# Altium schematic sheet PART10_Ast_Multivib_w_DC_DC_COnv.SchDoc
size A4
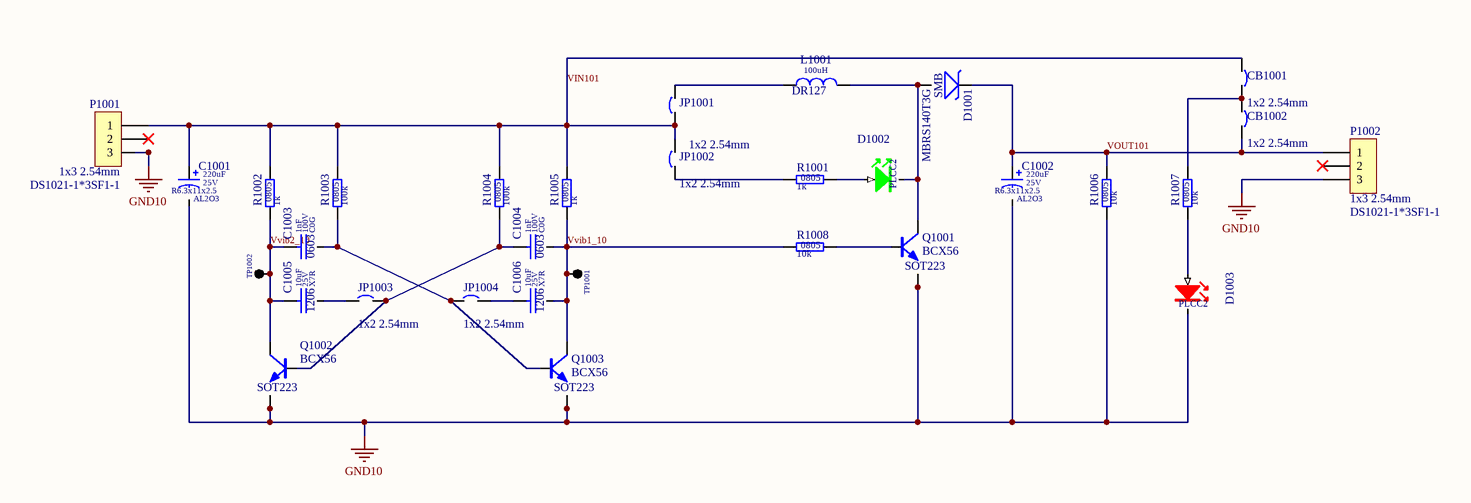
[diagram p0: PART10_Ast_Multivib_w_DC_DC_COnv.SchDoc]

## Parts
C1001  value 220uF  Dielectric: AL2O3  SCH_Footprint: R6.3x11x2.5  Voltage: 25V  [C_R6.3x11x2.5]  (hidden comment: Electrolytic Capacitor)
C1002  value 220uF  Dielectric: AL2O3  SCH_Footprint: R6.3x11x2.5  Voltage: 25V  [C_R6.3x11x2.5]  (hidden comment: Electrolytic Capacitor)
C1003  value 1nF  Dielectric: C0G  Voltage: 100V  SCH_Footprint: 0603  [C_0603_1608]  (hidden comment: Ceramic C0G)
C1004  value 1nF  Dielectric: C0G  Voltage: 100V  SCH_Footprint: 0603  [C_0603_1608]  (hidden comment: Ceramic C0G)
C1005  value 10uF  Dielectric: X7R  Voltage: 25V  SCH_Footprint: 1206  [C_1206_3216]  (hidden comment: Ceramic X7R)
C1006  value 10uF  Dielectric: X7R  Voltage: 25V  SCH_Footprint: 1206  [C_1206_3216]  (hidden comment: Ceramic X7R)
CB1001  SCH_Footprint: 1x2 2.54mm  [P_HEADER_1x2_2.54]  (hidden comment: Goldpin)
CB1002  SCH_Footprint: 1x2 2.54mm  [P_HEADER_1x2_2.54]  (hidden comment: Goldpin)
D1001  SCH_Footprint: SMB  [SMB_DO-214AA]  (hidden comment: MBRS140T3G)
D1002  SCH_Footprint: PLCC2  [OL_PLCC2_3X2X13]
D1003  SCH_Footprint: PLCC2  [OL_PLCC2_3X2X13]
JP1001  SCH_Footprint: 1x2 2.54mm  [P_HEADER_1x2_2.54]  (hidden comment: Goldpin)
JP1002  SCH_Footprint: 1x2 2.54mm  [P_HEADER_1x2_2.54]  (hidden comment: Goldpin)
JP1003  SCH_Footprint: 1x2 2.54mm  [P_HEADER_1x2_2.54]  (hidden comment: Goldpin)
JP1004  SCH_Footprint: 1x2 2.54mm  [P_HEADER_1x2_2.54]  (hidden comment: Goldpin)
L1001  value 100uH  SCH_Footprint: DR127  [L_DR127]  (hidden comment: Inductor)
P1001  value DS1021-1*3SF1-1  SCH_Footprint: 1x3 2.54mm  [P_HEADER_1x3_2.54]  (hidden comment: Goldpin)
P1002  value DS1021-1*3SF1-1  SCH_Footprint: 1x3 2.54mm  [P_HEADER_1x3_2.54]  (hidden comment: Goldpin)
Q1001  SCH_Footprint: SOT223  [SOT-223_M]  (hidden comment: BCX56)
Q1002  SCH_Footprint: SOT223  [SOT-223_M]  (hidden comment: BCX56)
Q1003  SCH_Footprint: SOT223  [SOT-223_M]  (hidden comment: BCX56)
R1001  value 1k  SCH_Footprint: 0805  [R_0805_2012]  (hidden comment: Resistor)
R1002  value 1k  SCH_Footprint: 0805  [R_0805_2012]  (hidden comment: Resistor)
R1003  value 100k  SCH_Footprint: 0805  [R_0805_2012]  (hidden comment: Resistor)
R1004  value 100k  SCH_Footprint: 0805  [R_0805_2012]  (hidden comment: Resistor)
R1005  value 1k  SCH_Footprint: 0805  [R_0805_2012]  (hidden comment: Resistor)
R1006  value 10k  SCH_Footprint: 0805  [R_0805_2012]  (hidden comment: Resistor)
R1007  value 10k  SCH_Footprint: 0805  [R_0805_2012]  (hidden comment: Resistor)
R1008  value 10k  SCH_Footprint: 0805  [R_0805_2012]  (hidden comment: Resistor)
TP1001  Single pin  [TP_1PIN]  (value not drawn)
TP1002  Single pin  [TP_1PIN]  (value not drawn)

## Nets
GND10: C1001.2 C1002.2 D1003.1(K) P1001.3 P1002.3 Q1001.1(C) Q1001.3(E) Q1002.1(C) Q1002.3(E) Q1003.1(C) Q1003.3(E) R1006.1
VIN101: C1001.1 CB1001.1 JP1001.1 JP1002.2 P1001.1 R1002.2 R1003.2 R1004.2 R1005.2
VOUT101: C1002.1 CB1002.2 D1001.1 P1002.1 R1006.2
Vvib1_10: C1004.2 C1006.2 Q1003.2(C) R1005.1 R1008.1 TP1001.1(TP)
Vvib2_10: C1003.1 C1005.1 Q1002.2(C) R1002.1 TP1002.1(TP)
NetC1003_2: C1003.2 JP1004.1 Q1003.4(B) R1003.1
NetC1004_1: C1004.1 JP1003.2 Q1002.4(B) R1004.1
NetC1005_2: C1005.2 JP1003.1
NetC1006_1: C1006.1 JP1004.2
NetCB1001_2: CB1001.2 CB1002.1 R1007.2
NetD1001_2: D1001.2 D1002.1(K) L1001.2 Q1001.2(C)
NetD1002_2: D1002.2(A) R1001.2
NetD1003_2: D1003.2(A) R1007.1
NetJP1001_2: JP1001.2 L1001.1
NetJP1002_1: JP1002.1 R1001.1
NetQ1001_4: Q1001.4(B) R1008.2

Not connected (* = marked no-connect by the designer): P1001 2*; P1002 2*

## Library data of the parts
C1001 C1002 = CE_220uF_25V_6.3x11x2.5_LESR_20: Polarized Capacitor; Manufacturer: Samxon; Manufacturer Part Number: GF 220U/25V; Tolerance (%): 20; Part Number: CE_220uF_25V_6.3x11x2.5_LESR_20; HelpURL: http://www.tme.eu/pl/Document/9fe41abe6e7b7973ea4089f212d099cc/E-GF_series.pdf; Supplier 1: TME; Supplier Part Number 1: GF220/25; Supplier 2: RS Components; Supplier 3: Farnell; Supplier 4: Mouser; Supplier 5: Digi-Key
C1003 C1004 = C_1nF_100V_C0G_0603_5: Capacitor; Manufacturer: Murata; Manufacturer Part Number: GRM1885C2A102JA01D; Tolerance (%): 5; Part Number: C_1nF_100V_C0G_0603_5; HelpURL: https://www.murata.com/~/media/webrenewal/support/library/catalog/products/capacitor/mlcc/c02e.ashx; Supplier 1: TME; Supplier Part Number 1: GRM1885C2A102JA01D; Supplier 2: RS Components; Supplier Part Number 2: 7235972; Supplier 3: Farnell; Supplier Part Number 3: 2494226; Supplier 4: Mouser; Supplier Part Number 4: 81-GRM1885C2A102JA01; Supplier 5: Digi-Key; Supplier Part Number 5: 490-3281-1-ND
C1005 C1006 = C_10uF_25V_X7R_1206_10: Capacitor; Manufacturer: Samsung Electro-Mechanics; Manufacturer Part Number: CL31B106KAHNNNE; Tolerance (%): 10; Part Number: C_10uF_25V_X7R_1206_10; HelpURL: http://www.tme.eu/pl/Document/4a42202b32dab16128fe107dd69598cc/samsung-chip-cap.pdf; Supplier 1: TME; Supplier Part Number 1: CL31B106KAHNNNE; Supplier 2: RS Components; Supplier 3: Farnell; Supplier 4: Mouser; Supplier 5: Digi-Key
CB1001 CB1002 JP1001-JP1004 = CB_GOLDPIN: Circuit Breaker; Part Number: CB_GOLDPIN; Component Type: Standard; Supplier 1: TME; Supplier 2: RS Components; Supplier 3: Farnell; Supplier 4: Mouser; Supplier 5: Digi-Key
D1001 = DS_MBRS140T3G_1A_40V_SMB: Manufacturer: ON Semiconductor; Voltage: 40V; Current: 1A; Value: MBRS140T3G; Part Number: DS_MBRS140T3G_1A_40V_SMB; Manufacturer Part Number: MBRS140T3G; Supplier 1: TME; Supplier 2: RS Components; Supplier 3: Farnell; Supplier 4: Mouser; Supplier 5: Digi-Key; Supplier Part Number 5: MBRS140T3GOSCT-ND
D1002 = OL_G_PLCC2: LED GREEN; Part Number: OL_G_PLCC2; Supplier 1: TME; Supplier 2: RS Components; Supplier 3: Farnell; Supplier 4: Mouser; Supplier Part Number 4: 720-LGT676P1Q224Z; Supplier 5: Digi-Key; Supplier Part Number 5: 475-1403-1-ND
D1003 = OL_R_PLCC2: LED_RED; Part Number: OL_R_PLCC2; Supplier 1: TME; Supplier 2: RS Components; Supplier 3: Farnell; Supplier 4: Mouser; Supplier Part Number 4: 720-LST676-R1S1-1-Z; Supplier 5: Digi-Key; Supplier Part Number 5: 475-2683-1-ND
L1001 = L_100uH_1.96A_DR127: Induction; Manufacturer: Eaton; Manufacturer Part Number: DR127-101-R; Current: 1.96A; Resistance: 163mR; Part Number: L_100uH_1.96A_DR127; HelpURL: https://datasheet.octopart.com/DR127-101-R-Eaton-datasheet-552538.pdf; Supplier 1: TME; Supplier 2: RS Components; Supplier Part Number 2: 7701003; Supplier 3: Farnell; Supplier Part Number 3: 1463472; Supplier 4: Mouser; Supplier Part Number 4: 704-DR127-101-R; Supplier 5: Digi-Key; Supplier Part Number 5: 513-1038-1-ND
P1001 P1002 = P_HEADER_1x3_2.54: Pin Header; Manufacturer: Connfly; Part Number: P_HEADER_1x3_2.54; Component Type: Standard; HelpURL: http://www.tme.eu/en/Document/cc301e58a5da78cb543a94b5a5b7f06a/DS1021.pdf; Manufacturer Part Number: DS1021-1*3SF1-1; Supplier 1: TME; Supplier Part Number 1: ZL201-03G; Supplier 2: RS Components; Supplier 3: Farnell; Supplier 4: Mouser; Supplier 5: Digi-Key
Q1001-Q1003 = QNP_BCX56: Manufacturer: Nexperia; Type: NPN; Voltage: 80V; Current: 1A; Part Number: QNP_BCX56; Value: BCX56; HelpURL: https://datasheet.octopart.com/BCX56-10%2C115-Nexperia-datasheet-78799842.pdf; Manufacturer Part Number: BCX56; Supplier 1: TME; Supplier 2: RS Components; Supplier Part Number 2: 725-8540; Supplier 3: Farnell; Supplier Part Number 3: 1757914; Supplier 4: Mouser; Supplier Part Number 4: 771-BCX56-10-T/R; Supplier 5: Digi-Key; Supplier Part Number 5: 1727-4318-1-ND-ND
R1001 R1002 R1005 = R_1k_0805_1: Manufacturer: Royalohm; Manufacturer Part Number: HP05W3F1001T5E; Voltage: 150V; Power: 300mW; Tolerance: 1%; Part Number: R_1k_0805_1; HelpURL: https://www.tme.eu/pl/Document/63d5a2fbb689d2d511047d7cc8640cd8/chip_resistor_hp.pdf; Supplier 1: TME; Supplier Part Number 1: HP05-1K1%; Supplier 2: RS Components; Supplier 3: Farnell; Supplier 4: Mouser; Supplier 5: Digi-Key
R1003 R1004 = R_100k_0805_1: Manufacturer: Yageo; Manufacturer Part Number: RC0805FR-07100KL; Voltage: 150V; Power: 125mW; Tolerance: 1%; Part Number: R_100k_0805_1; HelpURL: https://pl.mouser.com/datasheet/2/447/PYu-RC_Group_51_RoHS_L_9-1314892.pdf; Supplier 1: TME; Supplier Part Number 1: RC0805FR-07100K; Supplier 2: RS Components; Supplier 3: Farnell; Supplier Part Number 3: 9237879; Supplier 4: Mouser; Supplier Part Number 4: 603-RC0805FR-07100KL; Supplier 5: Digi-Key; Supplier Part Number 5: 311-100KCRCT-ND
R1006-R1008 = R_10k_0805_1: Manufacturer: Royalohm; Manufacturer Part Number: 0805S8F1002T5E; Voltage: 150V; Power: 125mW; Tolerance: 1%; Part Number: R_10k_0805_1; HelpURL: http://www.tme.eu/pl/Document/b315665a56acbc42df513c99b390ad98/ROYALOHM-THICKFILM.pdf; Supplier 1: TME; Supplier Part Number 1: SMD0805-10K-1%; Supplier 2: RS Components; Supplier 3: Farnell; Supplier 4: Mouser; Supplier 5: Digi-Key
TP1001 TP1002 = TP_1PIN: Testpoint; SCH_Footprint: Single; Part Number: TP_1PIN; Component Type: Standard; Supplier 1: TME; Supplier 2: RS Components; Supplier 3: Farnell; Supplier 4: Mouser; Supplier 5: Digi-Key